# EAGLE design mc_pcb (EAGLE 7.5.0)
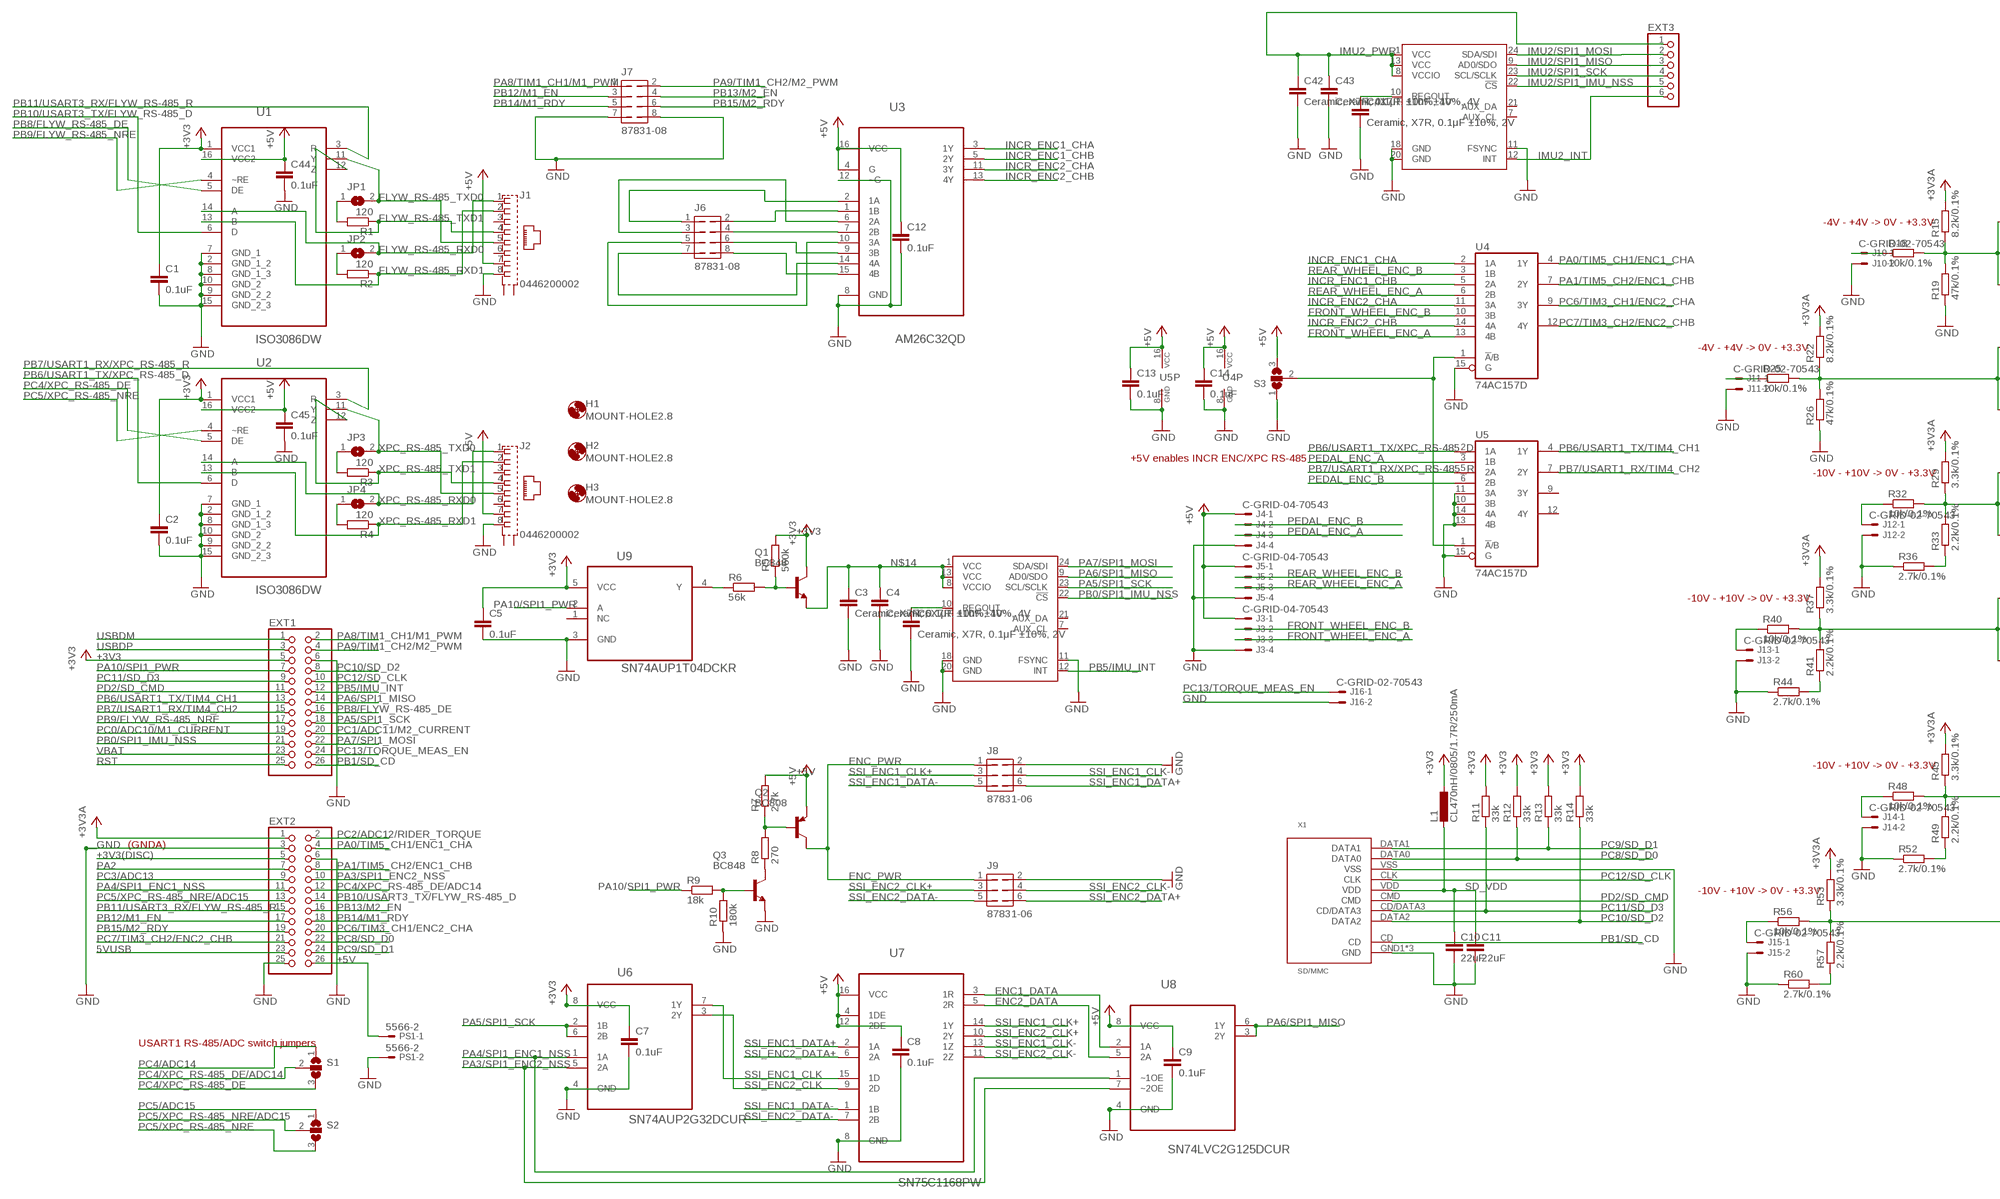
[diagram p0: schematic, sheet 1, part 1 of 2]
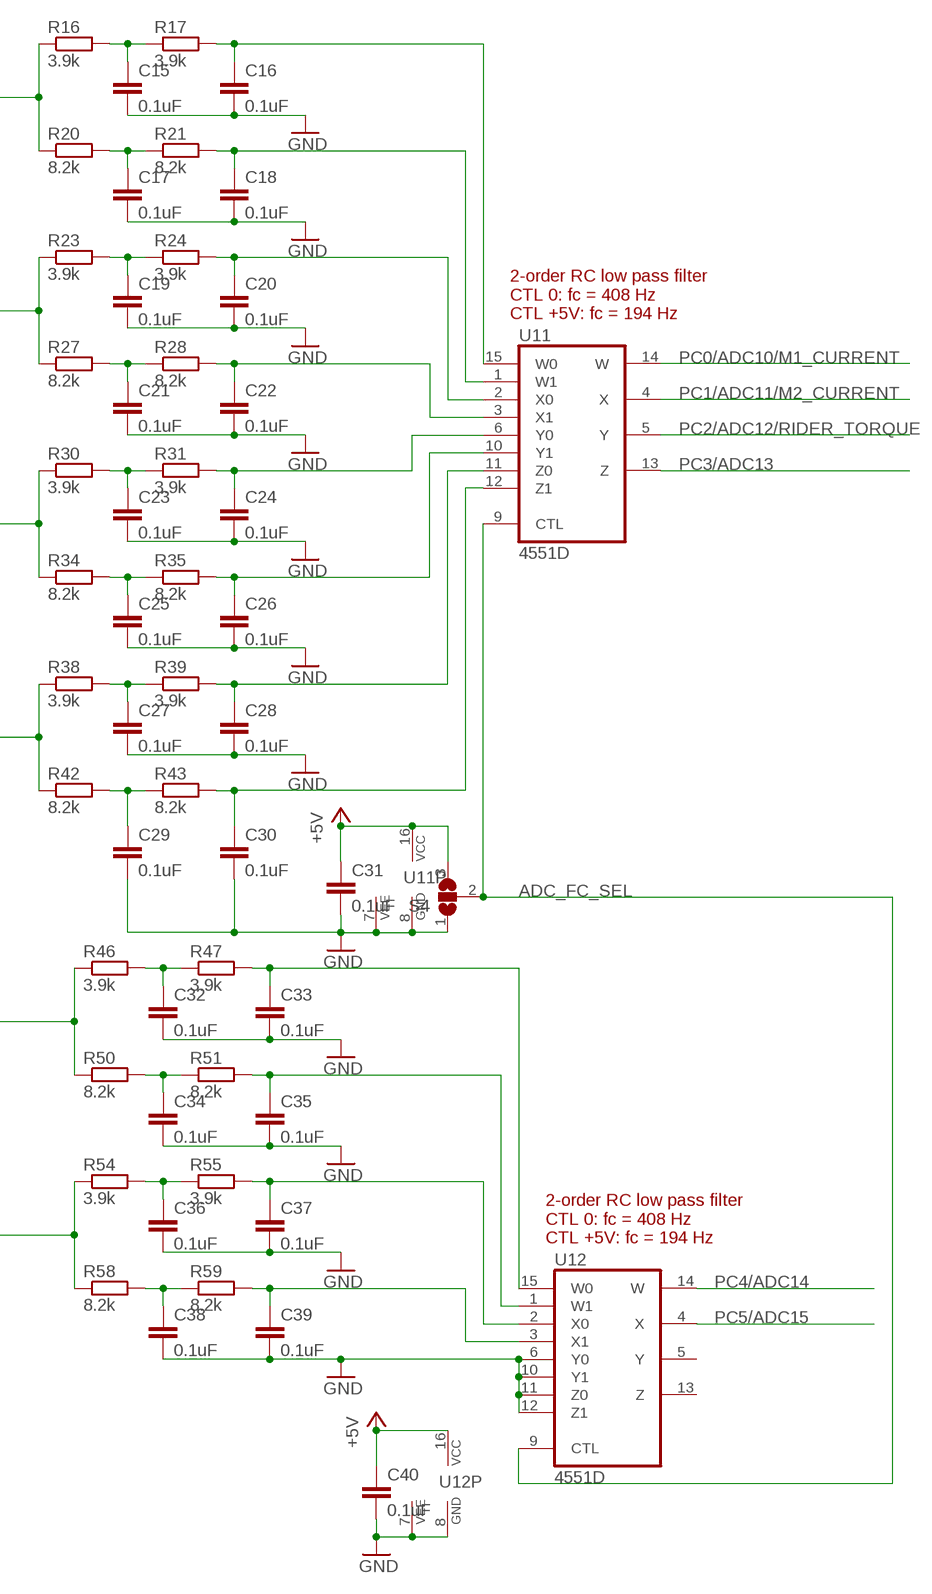
[diagram p1: schematic, sheet 1, part 2 of 2]

## Parts
C1  0.1uF  C-EUC0603  [C0603]
C2  0.1uF  C-EUC0603  [C0603]
C3  Ceramic, X7R, 0.1μF ±10%, 4V  C-EUC0603  [C0603]
C4  Ceramic, X7R, 10nF ±10%, 4V  C-EUC0603  [C0603]
C5  0.1uF  C-EUC0603  [C0603]
C6  Ceramic, X7R, 0.1μF ±10%, 2V  C-EUC0603  [C0603]
C7  0.1uF  C-EUC0603  [C0603]
C8  0.1uF  C-EUC0603  [C0603]
C9  0.1uF  C-EUC0603  [C0603]
C10  22uF  C-EUC0603  [C0603]
C11  22uF  C-EUC0603  [C0603]
C12  0.1uF  C-EUC0603  [C0603]
C13  0.1uF  C-EUC0603  [C0603]
C14  0.1uF  C-EUC0603  [C0603]
C15  0.1uF  C-EUC0603  [C0603]
C16  0.1uF  C-EUC0603  [C0603]
C17  0.1uF  C-EUC0603  [C0603]
C18  0.1uF  C-EUC0603  [C0603]
C19  0.1uF  C-EUC0603  [C0603]
C20  0.1uF  C-EUC0603  [C0603]
C21  0.1uF  C-EUC0603  [C0603]
C22  0.1uF  C-EUC0603  [C0603]
C23  0.1uF  C-EUC0603  [C0603]
C24  0.1uF  C-EUC0603  [C0603]
C25  0.1uF  C-EUC0603  [C0603]
C26  0.1uF  C-EUC0603  [C0603]
C27  0.1uF  C-EUC0603  [C0603]
C28  0.1uF  C-EUC0603  [C0603]
C29  0.1uF  C-EUC0603  [C0603]
C30  0.1uF  C-EUC0603  [C0603]
C31  0.1uF  C-EUC0603  [C0603]
C32  0.1uF  C-EUC0603  [C0603]
C33  0.1uF  C-EUC0603  [C0603]
C34  0.1uF  C-EUC0603  [C0603]
C35  0.1uF  C-EUC0603  [C0603]
C36  0.1uF  C-EUC0603  [C0603]
C37  0.1uF  C-EUC0603  [C0603]
C38  0.1uF  C-EUC0603  [C0603]
C39  0.1uF  C-EUC0603  [C0603]
C40  0.1uF  C-EUC0603  [C0603]
C41  Ceramic, X7R, 0.1μF ±10%, 2V  C-EUC0603  [C0603]
C42  Ceramic, X7R, 0.1μF ±10%, 4V  C-EUC0603  [C0603]
C43  Ceramic, X7R, 10nF ±10%, 4V  C-EUC0603  [C0603]
C44  0.1uF  C-EUC0603  [C0603]
C45  0.1uF  C-EUC0603  [C0603]
EXT1  PINHD-2X13  [2X13]
EXT2  PINHD-2X13  [2X13]
EXT3  PINHD-1X6  [1X06]
H1  MOUNT-HOLE2.8  [2,8]
H2  MOUNT-HOLE2.8  [2,8]
H3  MOUNT-HOLE2.8  [2,8]
J1  0446200002  [0446200002]
J2  0446200002  [0446200002]
J3  C-GRID-04-70543  [70543-04]
J4  C-GRID-04-70543  [70543-04]
J5  C-GRID-04-70543  [70543-04]
J6  87831-08  [87831-08]
J7  87831-08  [87831-08]
J8  87831-06  [87831-06]
J9  87831-06  [87831-06]
J10  C-GRID-02-70543  [70543-02]
J11  C-GRID-02-70543  [70543-02]
J12  C-GRID-02-70543  [70543-02]
J13  C-GRID-02-70543  [70543-02]
J14  C-GRID-02-70543  [70543-02]
J15  C-GRID-02-70543  [70543-02]
J16  C-GRID-02-70543  [70543-02]
JP1  SJ  [SJ]
JP2  SJ  [SJ]
JP3  SJ  [SJ]
JP4  SJ  [SJ]
L1  CL470nH/0805/1.7R/250mA  L-EUL2012C  [L2012C]
PS1  5566-2  [5566-2]
Q1  BC848  [SOT23]
Q2  BC808  BC808-16-PNP-SOT23-BEC  [SOT23-BEC]
Q3  BC848  [SOT23]
R1  120  R-EU_R0603  [R0603]
R2  120  R-EU_R0603  [R0603]
R3  120  R-EU_R0603  [R0603]
R4  120  R-EU_R0603  [R0603]
R5  560k  R-EU_R0603  [R0603]
R6  56k  R-EU_R0603  [R0603]
R7  2.7k  R-EU_R1210  [R1210]
R8  270  R-EU_R1210  [R1210]
R9  18k  R-EU_R0603  [R0603]
R10  180k  R-EU_R0603  [R0603]
R11  33k  R-EU_R0603  [R0603]
R12  33k  R-EU_R0603  [R0603]
R13  33k  R-EU_R0603  [R0603]
R14  33k  R-EU_R0603  [R0603]
R15  8.2k/0.1%  R-EU_R0603  [R0603]
R16  3.9k  R-EU_R0603  [R0603]
R17  3.9k  R-EU_R0603  [R0603]
R18  10k/0.1%  R-EU_R0603  [R0603]
R19  47k/0.1%  R-EU_R0603  [R0603]
R20  8.2k  R-EU_R0603  [R0603]
R21  8.2k  R-EU_R0603  [R0603]
R22  8.2k/0.1%  R-EU_R0603  [R0603]
R23  3.9k  R-EU_R0603  [R0603]
R24  3.9k  R-EU_R0603  [R0603]
R25  10k/0.1%  R-EU_R0603  [R0603]
R26  47k/0.1%  R-EU_R0603  [R0603]
R27  8.2k  R-EU_R0603  [R0603]
R28  8.2k  R-EU_R0603  [R0603]
R29  3.3k/0.1%  R-EU_R0603  [R0603]
R30  3.9k  R-EU_R0603  [R0603]
R31  3.9k  R-EU_R0603  [R0603]
R32  10k/0.1%  R-EU_R0603  [R0603]
R33  2.2k/0.1%  R-EU_R0603  [R0603]
R34  8.2k  R-EU_R0603  [R0603]
R35  8.2k  R-EU_R0603  [R0603]
R36  2.7k/0.1%  R-EU_R0603  [R0603]
R37  3.3k/0.1%  R-EU_R0603  [R0603]
R38  3.9k  R-EU_R0603  [R0603]
R39  3.9k  R-EU_R0603  [R0603]
R40  10k/0.1%  R-EU_R0603  [R0603]
R41  2.2k/0.1%  R-EU_R0603  [R0603]
R42  8.2k  R-EU_R0603  [R0603]
R43  8.2k  R-EU_R0603  [R0603]
R44  2.7k/0.1%  R-EU_R0603  [R0603]
R45  3.3k/0.1%  R-EU_R0603  [R0603]
R46  3.9k  R-EU_R0603  [R0603]
R47  3.9k  R-EU_R0603  [R0603]
R48  10k/0.1%  R-EU_R0603  [R0603]
R49  2.2k/0.1%  R-EU_R0603  [R0603]
R50  8.2k  R-EU_R0603  [R0603]
R51  8.2k  R-EU_R0603  [R0603]
R52  2.7k/0.1%  R-EU_R0603  [R0603]
R53  3.3k/0.1%  R-EU_R0603  [R0603]
R54  3.9k  R-EU_R0603  [R0603]
R55  3.9k  R-EU_R0603  [R0603]
R56  10k/0.1%  R-EU_R0603  [R0603]
R57  2.2k/0.1%  R-EU_R0603  [R0603]
R58  8.2k  R-EU_R0603  [R0603]
R59  8.2k  R-EU_R0603  [R0603]
R60  2.7k/0.1%  R-EU_R0603  [R0603]
S1  SJ2W  [SJ_2]
S2  SJ2W  [SJ_2]
S3  SJ2W  [SJ_2]
S4  SJ2W  [SJ_2]
U1  ISO3086DW  [SOIC127P1030X265-16N]
U2  ISO3086DW  [SOIC127P1030X265-16N]
U3  AM26C32QD  [SOIC127P600X175-16N]
U4  74AC157D  [SO16]
U5  74AC157D  [SO16]
U6  SN74AUP2G32DCUR  [SOP50P310X90-8N]
U7  SN75C1168PW  [SOP65P640X120-16N]
U8  SN74LVC2G125DCUR  [SOP50P310X90-8N]
U9  SN74AUP1T04DCKR  [SOT65P210X110-5N]
U10  MPU-9250  [QFN24-SMALL]
U11  4551D  [SO16]
U12  4551D  [SO16]
U13  MPU-9250  [QFN24-SMALL]
X1  10100660  [-68-6]

## Nets
5VUSB: EXT2.23
+3V3: C1.1 C2.1 C5.1 C7.1 EXT1.5 L1.1 Q1.3(C) R5.2 R11.2 R12.2 R13.2 R14.2 U1.1(VCC1) U2.1(VCC1) U6.8(VCC) U9.5(VCC)
+3V3(DISC): EXT2.5
+3V3A: EXT2.1 R15.2 R22.2 R29.2 R37.2 R45.2 R53.2
+5V: C8.1 C9.1 C12.1 C13.1 C14.1 C31.1 C40.1 C44.1 C45.1 EXT2.26 J1.7 J2.7 J3.1 J4.1 J5.1 PS1.1 Q2.E R7.2 S3.3 S4.3 U1.16(VCC2) U2.16(VCC2) U3.4(G) U3.16(VCC) U4.16(VCC) U5.16(VCC) U7.4(1DE) U7.12(2DE) U7.16(VCC) U8.8(VCC) U11.16(VCC) U12.16(VCC)
ADC_FC_SEL: S4.2 U11.9(CTL) U12.9(CTL)
ENC1_CHA+: J6.2 U3.1(1B)
ENC1_CHA-: J6.1 U3.2(1A)
ENC1_CHB+: J6.4 U3.7(2B)
ENC1_CHB-: J6.3 U3.6(2A)
ENC1_DATA: U7.3(1R) U8.2(1A)
ENC2_CHA+: J6.6 U3.9(3B)
ENC2_CHA-: J6.5 U3.10(3A)
ENC2_CHB+: J6.8 U3.15(4B)
ENC2_CHB-: J6.7 U3.14(4A)
ENC2_DATA: U7.5(2R) U8.5(2A)
ENC_PWR: J8.1 J9.1 Q2.C
FLYW_RS-485_RXD0: J1.1 JP2.2 U1.14(A)
FLYW_RS-485_RXD1: J1.2 R2.1 U1.13(B)
FLYW_RS-485_TXD0: J1.5 JP1.2 U1.11(Y)
FLYW_RS-485_TXD1: J1.4 R1.1 U1.12(Z)
FRONT_WHEEL_ENC_A: J3.3 U4.13(4B)
FRONT_WHEEL_ENC_B: J3.2 U4.10(3B)
GND: C1.2 C2.2 C3.2 C4.2 C5.2 C6.2 C7.2 C8.2 C9.2 C10.2 C11.2 C12.2 C13.2 C14.2 C15.2 C16.2 C17.2 C18.2 C19.2 C20.2 C21.2 C22.2 C23.2 C24.2 C25.2 C26.2 C27.2 C28.2 C29.2 C30.2 C31.2 C32.2 C33.2 C34.2 C35.2 C36.2 C37.2 C38.2 C39.2 C40.2 C41.2 C42.2 C43.2 C44.2 C45.2 EXT1.6 EXT2.3 EXT2.6 EXT2.25 J1.8 J2.8 J3.4 J4.4 J5.4 J7.7 J7.8 J8.2 J9.2 J10.2 J11.2 J12.2 J13.2 J14.2 J15.2 J16.2 PS1.2 Q3.2(E) R10.1 R19.1 R26.1 R36.1 R44.1 R52.1 R60.1 S3.1 S4.1 U1.2(GND_1_2) U1.7(GND_1) U1.8(GND_1_3) U1.9(GND_2_2) U1.10(GND_2) U1.15(GND_2_3) U2.2(GND_1_2) U2.7(GND_1) U2.8(GND_1_3) U2.9(GND_2_2) U2.10(GND_2) U2.15(GND_2_3) U3.8(GND) U3.12(~G) U4.8(GND) U4.15(G) U5.8(GND) U5.10(3B) U5.11(3A) U5.13(4B) U5.14(4A) U5.15(G) U6.4(GND) U7.8(GND) U8.4(GND) U9.3(GND) U10.11(FSYNC) U10.18(GND) U10.20(GND) U11.7(VEE) U11.8(GND) U12.6(Y0) U12.7(VEE) U12.8(GND) U12.10(Y1) U12.11(Z0) U12.12(Z1) U13.11(FSYNC) U13.18(GND) U13.20(GND) X1.GND1(GND) X1.GND2(GND) X1.GND3(GND) X1.VSS
IMU2/SPI1_IMU_NSS: EXT3.5 U13.22(!CS)
IMU2/SPI1_MISO: EXT3.3 U13.9(AD0/SDO)
IMU2/SPI1_MOSI: EXT3.2 U13.24(SDA/SDI)
IMU2/SPI1_SCK: EXT3.4 U13.23(SCL/SCLK)
IMU2_INT: EXT3.6 U13.12(INT)
IMU2_PWR: C42.1 C43.1 EXT3.1 U13.1(VCC) U13.8(VCCIO) U13.13(VCC)
INCR_ENC1_CHA: U3.3(1Y) U4.2(1A)
INCR_ENC1_CHB: U3.5(2Y) U4.5(2A)
INCR_ENC2_CHA: U3.11(3Y) U4.11(3A)
INCR_ENC2_CHB: U3.13(4Y) U4.14(4A)
N$1: C6.1 U10.10(REGOUT)
N$2: Q1.1(B) R5.1 R6.2
N$3: Q2.B R7.1 R8.2
N$4: Q3.3(C) R8.1
N$5: Q3.1(B) R9.2 R10.2
N$6: R33.1 R36.2
N$10: R29.1 R30.1 R32.2 R33.2 R34.1
N$12: C41.1 U13.10(REGOUT)
N$14: C3.1 C4.1 Q1.2(E) U10.1(VCC) U10.8(VCCIO) U10.13(VCC)
N$15: R15.1 R16.1 R18.2 R19.2 R20.1
N$17: R37.1 R38.1 R40.2 R41.2 R42.1
N$20: JP1.1 R1.2
N$24: JP3.1 R3.2
N$27: C32.1 R46.2 R47.1
N$28: C33.1 R47.2 U12.15(W0)
N$29: C34.1 R50.2 R51.1
N$31: C35.1 R51.2 U12.1(W1)
N$32: C36.1 R54.2 R55.1
N$33: C37.1 R55.2 U12.2(X0)
N$34: C38.1 R58.2 R59.1
N$35: C39.1 R59.2 U12.3(X1)
N$37: R6.1 U9.4(Y)
N$42: J15.1 R56.1
N$45: R22.1 R23.1 R25.2 R26.2 R27.1
N$47: J14.1 R48.1
N$49: S3.2 U4.1(!A!/B) U5.1(!A!/B)
N$50: J12.1 R32.1
N$51: JP2.1 R2.2
N$52: JP4.1 R4.2
N$53: J10.1 R18.1
N$56: C23.1 R30.2 R31.1
N$57: C24.1 R31.2 U11.6(Y0)
N$58: R41.1 R44.2
N$59: R45.1 R46.1 R48.2 R49.2 R50.1
N$60: R49.1 R52.2
N$61: R53.1 R54.1 R56.2 R57.2 R58.1
N$62: R57.1 R60.2
N$63: J13.1 R40.1
N$64: C25.1 R34.2 R35.1
N$65: C26.1 R35.2 U11.10(Y1)
N$66: C27.1 R38.2 R39.1
N$67: C28.1 R39.2 U11.11(Z0)
N$68: C29.1 R42.2 R43.1
N$69: C30.1 R43.2 U11.12(Z1)
N$70: C15.1 R16.2 R17.1
N$71: C16.1 R17.2 U11.15(W0)
N$72: C17.1 R20.2 R21.1
N$73: C18.1 R21.2 U11.1(W1)
N$74: C19.1 R23.2 R24.1
N$75: C20.1 R24.2 U11.2(X0)
N$76: C21.1 R27.2 R28.1
N$77: C22.1 R28.2 U11.3(X1)
PA0/TIM5_CH1/ENC1_CHA: EXT2.4 U4.4(1Y)
PA1/TIM5_CH2/ENC1_CHB: EXT2.8 U4.7(2Y)
PA2: EXT2.7
PA3/SPI1_ENC2_NSS: EXT2.10 U6.5(2A) U8.7(~2OE)
PA4/SPI1_ENC1_NSS: EXT2.11 U6.1(1A) U8.1(~1OE)
PA5/SPI1_SCK: EXT1.18 U6.2(1B) U6.6(2B) U10.23(SCL/SCLK)
PA6/SPI1_MISO: EXT1.14 U8.3(2Y) U8.6(1Y) U10.9(AD0/SDO)
PA7/SPI1_MOSI: EXT1.22 U10.24(SDA/SDI)
PA8/TIM1_CH1/M1_PWM: EXT1.2 J7.1
PA9/TIM1_CH2/M2_PWM: EXT1.4 J7.2
PA10/SPI1_PWR: EXT1.7 R9.1 U9.2(A)
PB0/SPI1_IMU_NSS: EXT1.21 U10.22(!CS)
PB1/SD_CD: EXT1.26 X1.CD
PB5/IMU_INT: EXT1.12 U10.12(INT)
PB6/USART1_TX/TIM4_CH1: EXT1.13 U5.4(1Y)
PB6/USART1_TX/XPC_RS-485_D: U2.6(D) U5.2(1A)
PB7/USART1_RX/TIM4_CH2: EXT1.15 U5.7(2Y)
PB7/USART1_RX/XPC_RS-485_R: U2.3(R) U5.5(2A)
PB8/FLYW_RS-485_DE: EXT1.16 U1.5(DE)
PB9/FLYW_RS-485_NRE: EXT1.17 U1.4(~RE)
PB10/USART3_TX/FLYW_RS-485_D: EXT2.14 U1.6(D)
PB11/USART3_RX/FLYW_RS-485_R: EXT2.15 U1.3(R)
PB12/M1_EN: EXT2.17 J7.3
PB13/M2_EN: EXT2.16 J7.4
PB14/M1_RDY: EXT2.18 J7.5
PB15/M2_RDY: EXT2.19 J7.6
PC0/ADC10/M1_CURRENT: EXT1.19 U11.14(W)
PC1/ADC11/M2_CURRENT: EXT1.20 U11.4(X)
PC2/ADC12/RIDER_TORQUE: EXT2.2 U11.5(Y)
PC3/ADC13: EXT2.9 U11.13(Z)
PC4/ADC14: S1.1 U12.14(W)
PC4/XPC_RS-485_DE: S1.3 U2.5(DE)
PC4/XPC_RS-485_DE/ADC14: EXT2.12 S1.2
PC5/ADC15: S2.1 U12.4(X)
PC5/XPC_RS-485_NRE: S2.3 U2.4(~RE)
PC5/XPC_RS-485_NRE/ADC15: EXT2.13 S2.2
PC6/TIM3_CH1/ENC2_CHA: EXT2.20 U4.9(3Y)
PC7/TIM3_CH2/ENC2_CHB: EXT2.21 U4.12(4Y)
PC8/SD_D0: EXT2.22 R12.1 X1.DATA0
PC9/SD_D1: EXT2.24 R13.1 X1.DATA1
PC10/SD_D2: EXT1.8 R14.1 X1.DATA2
PC11/SD_D3: EXT1.9 R11.1 X1.CD/DATA3
PC12/SD_CLK: EXT1.10 X1.CLK
PC13/TORQUE_MEAS_EN: EXT1.24 J16.1
PD2/SD_CMD: EXT1.11 X1.CMD
PEDAL_ENC_A: J4.3 U5.3(1B)
PEDAL_ENC_B: J4.2 U5.6(2B)
REAR_WHEEL_ENC_A: J5.3 U4.6(2B)
REAR_WHEEL_ENC_B: J5.2 U4.3(1B)
RST: EXT1.25
SD_VDD: C10.1 C11.1 L1.2 X1.VDD
SSI_ENC1_CLK: U6.7(1Y) U7.15(1D)
SSI_ENC1_CLK+: J8.3 U7.14(1Y)
SSI_ENC1_CLK-: J8.4 U7.13(1Z)
SSI_ENC1_DATA+: J8.6 U7.2(1A)
SSI_ENC1_DATA-: J8.5 U7.1(1B)
SSI_ENC2_CLK: U6.3(2Y) U7.9(2D)
SSI_ENC2_CLK+: J9.3 U7.10(2Y)
SSI_ENC2_CLK-: J9.4 U7.11(2Z)
SSI_ENC2_DATA+: J9.6 U7.6(2A)
SSI_ENC2_DATA-: J9.5 U7.7(2B)
USBDM: EXT1.1
USBDP: EXT1.3
VBAT: EXT1.23
X124: J11.1 R25.1
XPC_RS-485_RXD0: J2.1 JP4.2 U2.14(A)
XPC_RS-485_RXD1: J2.2 R4.1 U2.13(B)
XPC_RS-485_TXD0: J2.5 JP3.2 U2.11(Y)
XPC_RS-485_TXD1: J2.4 R3.1 U2.12(Z)
Unconnected: J1.3 J1.6 J1.S@1(S1) J1.S@2(S2) J2.3 J2.6 J2.S@1(S1) J2.S@2(S2) U5.9(3Y) U5.12(4Y) U9.1(NC) U10.7(AUX_CL) U10.21(AUX_DA) U12.5(Y) U12.13(Z) U13.7(AUX_CL) U13.21(AUX_DA)

## Notes on the sheet
- -4V - +4V -> 0V - +3.3V
- -4V - +4V -> 0V - +3.3V
- 2-order RC low pass filter
  CTL 0: fc = 408 Hz
  CTL +5V: fc = 194 Hz
- +5V enables INCR ENC/XPC RS-485
- -10V - +10V -> 0V - +3.3V
- -10V - +10V -> 0V - +3.3V
- -10V - +10V -> 0V - +3.3V
- (GNDA)
- -10V - +10V -> 0V - +3.3V
- 2-order RC low pass filter
  CTL 0: fc = 408 Hz
  CTL +5V: fc = 194 Hz
- USART1 RS-485/ADC switch jumpers

## Library data of the parts
C1-C45 = rcl:C-EU: CAPACITOR, European symbol
EXT1 EXT2 = pinhead:PINHD-2X13: PIN HEADER
EXT3 = pinhead:PINHD-1X6: PIN HEADER
H1-H3 = holes:MOUNT-HOLE: MOUNTING HOLE with drill center marker
J1 J2 = con-molex:0446200002: RJ-45 INVERTED MODULAR JACK ASSEMBLY WITH RJ-11 KEEPOUT FEATURE Source: Data sheet <http://www.farnell.com/datasheets/73207.pdf> MOLEX 0446200002 BUCHSE, RJ45, GESCHIRMT Source: Farnell <http://de.farnell.com/molex/0446200002/buchse-rj45-geschirmt/dp/9251910?ost=9251910>; MF: MOLEX; MPN: 0446200002; OC_FARNELL: 9251910
J3-J5 = con-molex:C-GRID-04: CONNECTOR wire to board 2.54 mm (0.100") pitch header; OC_FARNELL: unknown; OC_NEWARK: unknown
J6 J7 = components:87831-08: Milli-Grid Header 2.00mm (.079") Pitch; OC_FARNELL: unknown; OC_NEWARK: unknown
J8 J9 = components:87831-06: Milli-Grid Header 2.00mm (.079") Pitch; OC_FARNELL: 1756947; OC_NEWARK: unknown
J10-J16 = con-molex:C-GRID-02: CONNECTOR wire to board 2.54 mm (0.100") pitch header; OC_FARNELL: unknown; OC_NEWARK: unknown
JP1-JP4 = jumper:SJ: SMD solder JUMPER
L1 = rcl:L-EU: INDUCTOR, European symbol
PS1 = con-molex:5566-2: Mini FIT connector 2 pol Source: http://www.molex.com; OC_FARNELL: 1822072; OC_NEWARK: unknown
Q1 Q3 = transistor:BC848: NPN TRANSISTOR
Q2 = transistor:*-PNP-: PNP Transistror
R1-R60 = rcl:R-EU_: RESISTOR, European symbol
S1-S4 = jumper:SJ2W: SMD solder JUMPER
U1 U2 = Texas_Instruments_By_element14_Batch_1:ISO3086DW: ISOLATED 5-V FULL AND HALF-DUPLEX RS-485 TRANSCEIVERS; MPN: ISO3080DW; OC_FARNELL: 1755041; OC_NEWARK: 13N4115; PACKAGE: SOIC-16; SUPPLIER: TEXAS INSTRUMENTS
U3 = Texas Instruments_By_element14_Batch_1:AM26C32QD: QUADRUPLE DIFFERENTIAL LINE RECEIVER; MPN: AM26C32QD; OC_FARNELL: -; OC_NEWARK: 50R9732; PACKAGE: SOIC-16; SUPPLIER: Texas Instruments
U4 U5 = 74xx-eu:74*157: Quadruple 2-line to 1-line data SELECTOR/MULTIPLEXER
U6 = Texas Instruments_By_element14_Batch_1:SN74AUP2G32DCUR: LOW-POWER DUAL 2-INPUT POSITIVE-OR GATE; MPN: SN74AUP2G32DCUR; OC_FARNELL: -; OC_NEWARK: 64R0600; PACKAGE: SOP-8; SUPPLIER: Texas Instruments
U7 = Texas Instruments_By_element14_Batch_1:SN75C1168PW: DUAL DIFFERENTIAL DRIVERS AND RECEIVERS; MPN: SN75C1168PW; OC_FARNELL: 4904163; OC_NEWARK: 02H5485; PACKAGE: TSSOP-16; SUPPLIER: Texas Instruments
U8 = Texas Instruments_By_element14_Batch_1:SN74LVC2G125DCUR: DUAL BUS BUFFER; MPN: SN74LVC2G125DCUR; OC_FARNELL: 1287415; OC_NEWARK: 76C4200; PACKAGE: VSSOP-8; SUPPLIER: Texas Instruments
U9 = Texas Instruments_By_element14_Batch_1:SN74AUP1T04DCKR: LOW POWER, 1.8/2.5/3.3-V INPUT, 3.3-V CMOS OUTPUT, SINGLE INVERTER GATE; MPN: SN74AUP1T04DCKR; OC_FARNELL: -; OC_NEWARK: 74R6552; PACKAGE: SC70-5; SUPPLIER: Texas Instruments
U10 U13 = MPU-9250:MPU-9250
U11 U12 = 45xx:4551: Quad 2-channel analog MULTIPLEXER/DEMULTIPLEXER
X1 = components:10100660: AMPHENOL microDS push push connector (9pin)

## Board
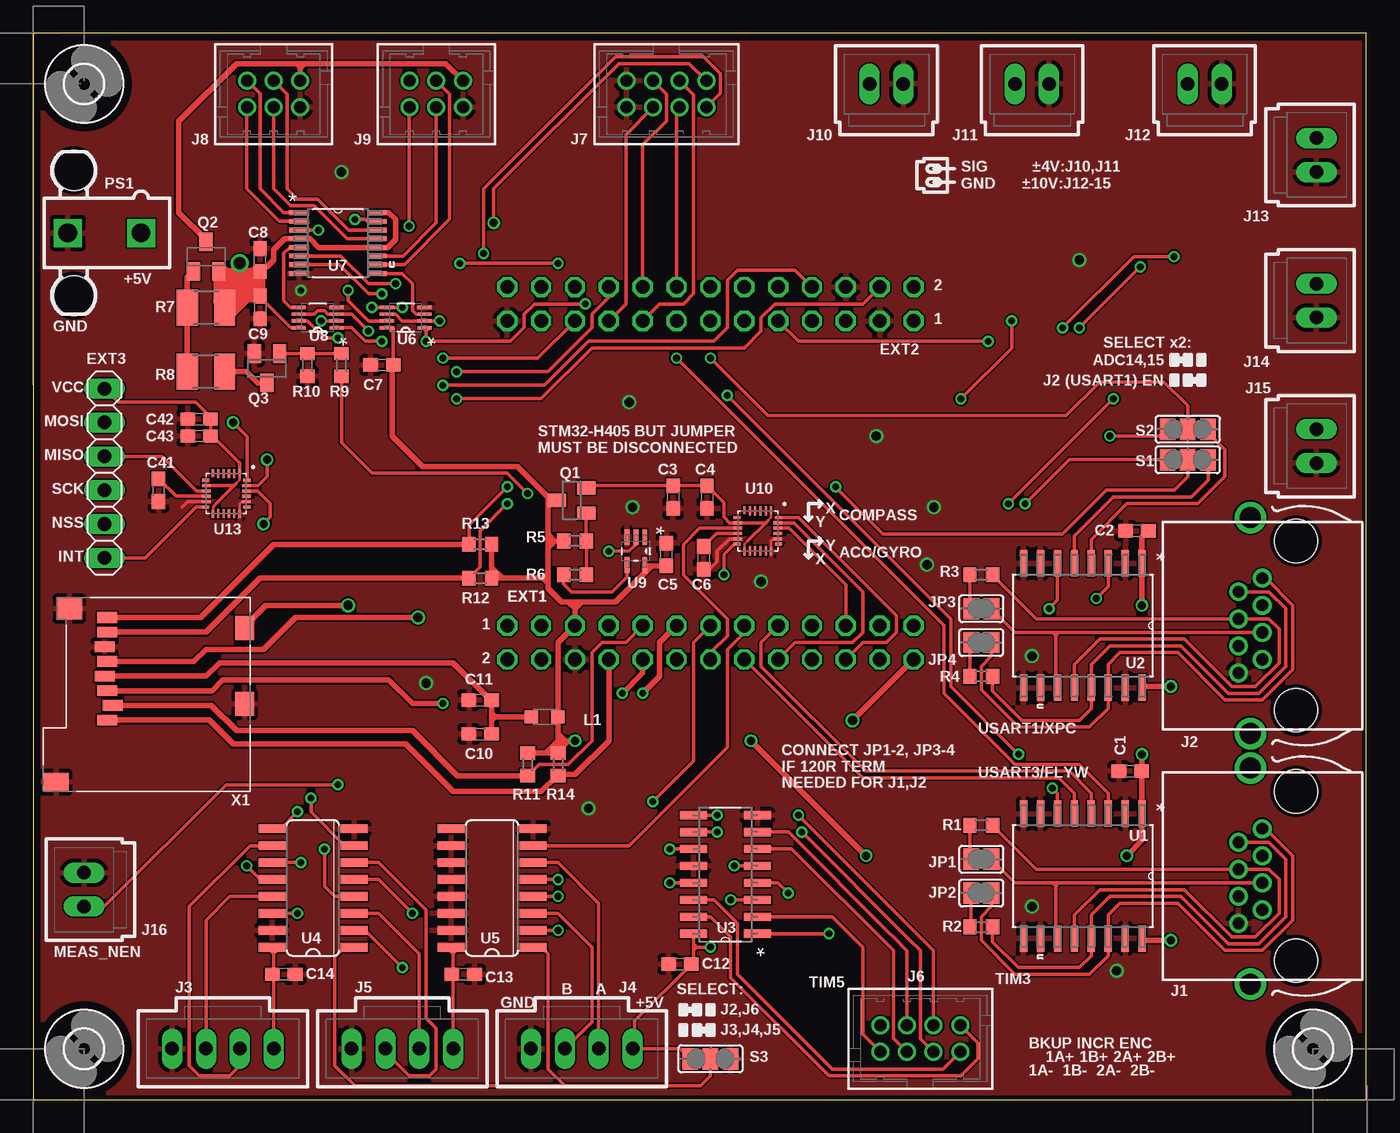
[diagram p2: board, top side]
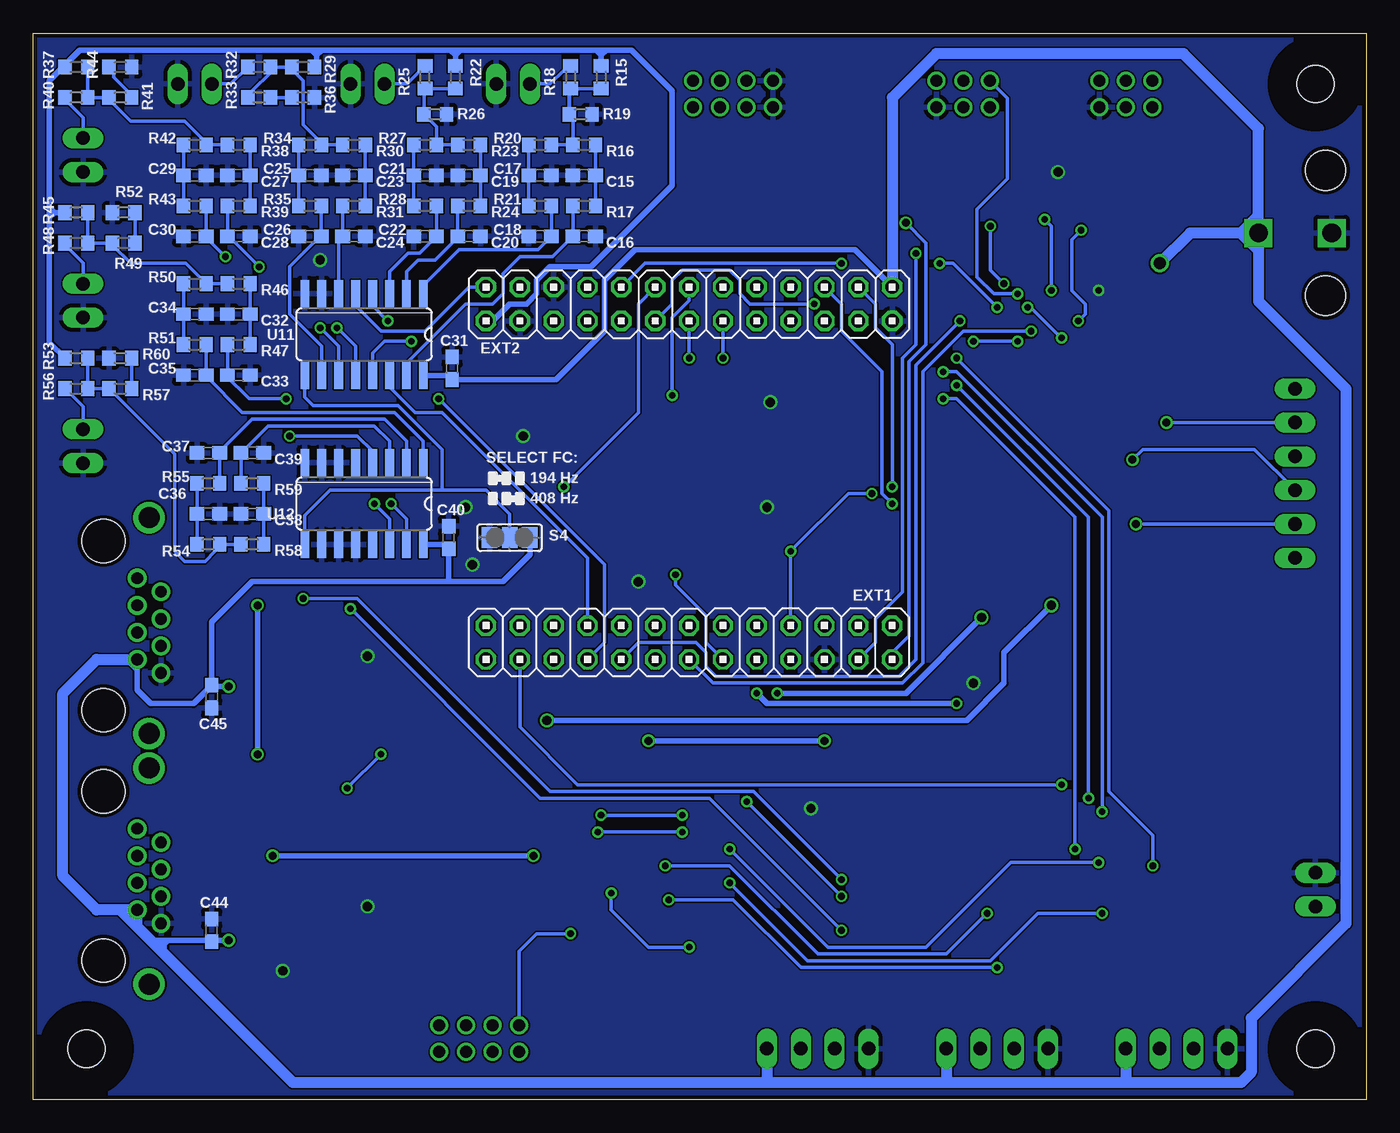
[diagram p3: board, bottom side, seen from below]

Size 100 x 80 mm. Coordinates in mm from the lower left corner, seen from the top.
Outline: 0,0 100,0 100,80 0,80 0,0
Copper layers (1*16): Top 0.035mm / dielectric 1.55mm / Bottom 0.035mm
Design rules "Eagle_WEdirekt_125_check *": minimum track width 0.125mm, minimum drill 0.2mm, track to track 0.125mm, track to pad 0.125mm, pad to pad 0.17mm, via to via 0.125mm, smd to smd 0.17mm, copper to edge 0.3mm, drill to drill 0.6mm, minimum pad ring 0.225mm, minimum via ring 0.175mm, stop-mask expansion 0.05mm, vias tented up to drill 0mil, thermal gap 0.3mm

### Footprints (pad centres in the part's own frame; a part is rotated, then mirrored left to right if it is on the bottom)
C0603 = smd 1.1 x 1: 1 -0.85,0; 2 0.85,0
2X13 = drill 1.016 octagon: 1 -15.24,-1.27; 2 -15.24,1.27; 3 -12.7,-1.27; 4 -12.7,1.27; 5 -10.16,-1.27; 6 -10.16,1.27; 7 -7.62,-1.27; 8 -7.62,1.27; 9 -5.08,-1.27; 10 -5.08,1.27; 11 -2.54,-1.27; 12 -2.54,1.27; 13 0,-1.27; 14 0,1.27; 15 2.54,-1.27; 16 2.54,1.27; 17 5.08,-1.27; 18 5.08,1.27; 19 7.62,-1.27; 20 7.62,1.27; 21 10.16,-1.27; 22 10.16,1.27; 23 12.7,-1.27; 24 12.7,1.27; 25 15.24,-1.27; 26 15.24,1.27
1X06 = drill 1.016 long: 1 -6.35,0; 2 -3.81,0; 3 -1.27,0; 4 1.27,0; 5 3.81,0; 6 6.35,0
2,8 = hole 2.8: 0,0
0446200002 = drill 0.889 pad 1.422: 1 3.556,2.54; 2 2.54,4.318; 3 1.524,2.54; 4 0.508,4.318; 5 -0.508,2.54; 6 -1.524,4.318; 7 -2.54,2.54; 8 -3.556,4.318 | drill 1.575 pad 2.286: S@1 -8.103,3.429; S@2 8.103,3.429 | hole 3.251: 6.35,0; -6.35,0
70543-04 = drill 1.016 long: 1 -3.81,0; 2 -1.27,0; 3 1.27,0; 4 3.81,0
87831-08 = drill 0.9: 1 -3,-1; 2 -3,1; 3 -1,-1; 4 -1,1; 5 1,-1; 6 1,1; 7 3,-1; 8 3,1
87831-06 = drill 0.9: 1 -2,-1; 2 -2,1; 3 0,-1; 4 0,1; 5 2,-1; 6 2,1
70543-02 = drill 1.016 long: 1 -1.27,0; 2 1.27,0
SJ = smd 1.168 x 1.6: 1 -0.762,0; 2 0.762,0
L2012C = smd 1 x 1: 1 -1,0; 2 1,0
5566-2 = drill 1.4 square: 1 0,-2.75; 2 0,2.75 | hole 3: 4.7,2.29; -4.7,2.29
SOT23 = smd 1 x 1.4: 1 -0.95,-1.1; 2 0.95,-1.1; 3 0,1.1
SOT23-BEC = smd 1 x 1.4: B -0.95,-1.1; C 0,1.1; E 0.95,-1.1
R0603 = smd 1 x 1.1: 1 -0.85,0; 2 0.85,0
R1210 = smd 1.6 x 2.7: 1 -1.4,0; 2 1.4,0
SJ_2 = smd 1.168 x 1.6: 1 -1.524,0; 2 0,0; 3 1.524,0
SOIC127P1030X265-16N = smd 1.981 x 0.559: 1 -4.674,4.445; 2 -4.674,3.175; 3 -4.674,1.905; 4 -4.674,0.635; 5 -4.674,-0.635; 6 -4.674,-1.905; 7 -4.674,-3.175; 8 -4.674,-4.445; 9 4.674,-4.445; 10 4.674,-3.175; 11 4.674,-1.905; 12 4.674,-0.635; 13 4.674,0.635; 14 4.674,1.905; 15 4.674,3.175; 16 4.674,4.445
SOIC127P600X175-16N = smd 2.057 x 0.61: 1 -4.801,8.89; 2 -4.801,7.62; 3 -4.801,6.35; 4 -4.801,5.08; 5 -4.801,3.81; 6 -4.801,2.54; 7 -4.801,1.27; 8 -4.801,0; 9 0,0; 10 0,1.27; 11 0,2.54; 12 0,3.81; 13 0,5.08; 14 0,6.35; 15 0,7.62; 16 0,8.89
SO16 = smd 0.66 x 2.032: 1 -4.445,-3.073; 2 -3.175,-3.073; 3 -1.905,-3.073; 4 -0.635,-3.073; 5 0.635,-3.073; 6 1.905,-3.073; 7 3.175,-3.073; 8 4.445,-3.073; 9 4.445,3.073; 10 3.175,3.073; 11 1.905,3.073; 12 0.635,3.073; 13 -0.635,3.073; 14 -1.905,3.073; 15 -3.175,3.073; 16 -4.445,3.073
SOP50P310X90-8N = smd 1.067 x 0.254: 1 -1.422,0.762; 2 -1.422,0.254; 3 -1.422,-0.254; 4 -1.422,-0.762; 5 1.422,-0.762; 6 1.422,-0.254; 7 1.422,0.254; 8 1.422,0.762
SOP65P640X120-16N = smd 1.473 x 0.356: 1 -2.921,2.286; 2 -2.921,1.626; 3 -2.921,0.965; 4 -2.921,0.33; 5 -2.921,-0.33; 6 -2.921,-0.965; 7 -2.921,-1.626; 8 -2.921,-2.286; 9 2.921,-2.286; 10 2.921,-1.626; 11 2.921,-0.965; 12 2.921,-0.33; 13 2.921,0.33; 14 2.921,0.965; 15 2.921,1.626; 16 2.921,2.286
SOT65P210X110-5N = smd 1.168 x 0.356: 1 -1.041,0.66; 2 -1.041,0; 3 -1.041,-0.66; 4 1.041,-0.66; 5 1.041,0.66
QFN24-SMALL = smd 0.6 x 0.23: 1 -1.55,1; 6 -1.55,-1; 13 1.55,-1; 18 1.55,1 | smd 0.7 x 0.23: 2 -1.5,0.6; 3 -1.5,0.2; 4 -1.5,-0.2; 5 -1.5,-0.6; 14 1.5,-0.6; 15 1.5,-0.2; 16 1.5,0.2; 17 1.5,0.6 | smd 0.23 x 0.6: 7 -1,-1.55; 12 1,-1.55; 19 1,1.55; 24 -1,1.55 | smd 0.23 x 0.7: 8 -0.6,-1.5; 9 -0.2,-1.5; 10 0.2,-1.5; 11 0.6,-1.5; 20 0.6,1.5; 21 0.2,1.5; 22 -0.2,1.5; 23 -0.6,1.5
-68-6 = smd 1.4 x 1.8: CD 7.22,4.63; GND3 7.22,-1.07 | smd 1.5 x 0.8: CD/DATA3 -2.68,-1.16; CLK -3.08,2.14; CMD -3.08,-0.06; DATA0 -3.08,4.34; DATA1 -3.08,5.44; DATA2 -3.08,-2.26; VDD -3.28,1.04; VSS -3.28,3.24 | smd 1.9 x 1.4: GND1 -6.93,-6.92 | smd 1.9 x 1.65: GND2 -5.93,6.105

### Placement (x,y rotation side)
C1  82.3,24.64 180 top
C2  82.8,42.67 180 top
C3  48.01,45.21 270 top
C4  50.55,45.21 270 top
C5  47.5,40.89 90 top
C6  50.29,40.64 270 top
C7  26.16,55.12 180 top
C8  17.02,62.99 90 top
C9  17.02,59.44 270 top
C10  33.53,27.43 180 top
C11  33.53,29.97 180 top
C12  48.51,10.16 180 top
C13  32.26,9.4 0 top
C14  18.8,9.4 0 top
C15  58.67,69.34 180 bottom
C16  58.67,64.77 0 bottom
C17  61.98,69.34 0 bottom
C18  61.98,64.77 180 bottom
C19  67.31,69.34 180 bottom
C20  67.31,64.77 0 bottom
C21  70.61,69.34 0 bottom
C22  70.61,64.77 180 bottom
C23  75.95,69.34 180 bottom
C24  75.95,64.77 0 bottom
C25  79.25,69.34 0 bottom
C26  79.25,64.77 180 bottom
C27  84.58,69.34 180 bottom
C28  84.58,64.77 0 bottom
C29  87.88,69.34 0 bottom
C30  87.88,64.77 180 bottom
C31  68.58,54.86 90 bottom
C32  84.58,58.93 180 bottom
C33  84.58,54.36 0 bottom
C34  87.88,58.93 0 bottom
C35  87.88,54.36 180 bottom
C36  86.87,43.94 0 bottom
C37  86.87,48.51 180 bottom
C38  83.57,43.94 180 bottom
C39  83.57,48.51 0 bottom
C40  68.83,42.16 90 bottom
C41  9.4,45.72 270 top
C42  12.45,51.05 180 top
C43  12.45,49.78 180 top
C44  86.61,12.7 90 bottom
C45  86.61,30.23 270 bottom
EXT1  50.8,34.29 180 bottom
EXT2  50.8,59.69 0 bottom
EXT3  5.33,46.99 270 top
H1  3.81,3.81 0 top
H2  96.01,3.81 0 top
H3  3.81,76.2 0 top
J1  94.74,16.76 90 top
J2  94.74,35.56 90 top
J3  14.22,3.81 180 top
J4  41.15,3.81 180 top
J5  27.69,3.81 180 top
J6  66.55,4.57 0 top
J7  47.5,75.44 180 top
J8  18.03,75.44 180 top
J9  30.23,75.44 180 top
J10  64.01,76.2 0 top
J11  74.93,76.2 0 top
J12  87.88,76.2 0 top
J13  96.27,70.87 270 top
J14  96.27,59.94 270 top
J15  96.27,49.02 270 top
J16  3.81,15.75 90 top
JP1  71.12,18.03 0 top
JP2  71.12,15.49 0 top
JP3  71.12,36.83 0 top
JP4  71.12,34.29 0 top
L1  38.35,28.7 180 top
PS1  5.33,65.02 90 top
Q1  40.39,44.96 90 top
Q2  12.95,63.25 0 top
Q3  17.53,54.86 180 top
R1  71.12,20.57 180 top
R2  71.12,12.95 180 top
R3  71.12,39.37 180 top
R4  71.12,31.75 180 top
R5  40.64,41.91 180 top
R6  40.64,39.37 0 top
R7  12.95,59.44 0 top
R8  12.95,54.61 180 top
R9  23.11,55.12 90 top
R10  20.57,55.12 90 top
R11  37.08,25.15 90 top
R12  33.53,39.12 0 top
R13  33.53,41.66 0 top
R14  39.37,25.15 90 top
R15  57.4,76.71 90 bottom
R16  58.67,71.63 0 bottom
R17  58.67,67.06 180 bottom
R18  59.69,76.71 270 bottom
R19  58.93,73.91 180 bottom
R20  61.98,71.63 180 bottom
R21  61.98,67.06 0 bottom
R22  68.33,76.71 90 bottom
R23  67.31,71.63 0 bottom
R24  67.31,67.06 180 bottom
R25  70.61,76.71 270 bottom
R26  69.85,73.91 180 bottom
R27  70.61,71.63 180 bottom
R28  70.61,67.06 0 bottom
R29  79.76,77.47 0 bottom
R30  75.95,71.63 0 bottom
R31  75.95,67.06 180 bottom
R32  83.06,77.47 0 bottom
R33  83.06,75.18 180 bottom
R34  79.25,71.63 180 bottom
R35  79.25,67.06 0 bottom
R36  79.76,75.18 180 bottom
R37  96.77,77.47 180 bottom
R38  84.58,71.63 0 bottom
R39  84.58,67.06 180 bottom
R40  96.77,75.18 0 bottom
R41  93.47,75.18 180 bottom
R42  87.88,71.63 180 bottom
R43  87.88,67.06 0 bottom
R44  93.47,77.47 180 bottom
R45  96.77,66.55 180 bottom
R46  84.58,61.21 0 bottom
R47  84.58,56.64 180 bottom
R48  96.77,64.26 0 bottom
R49  93.22,64.26 180 bottom
R50  87.88,61.21 180 bottom
R51  87.88,56.64 0 bottom
R52  93.22,66.55 0 bottom
R53  96.77,55.63 180 bottom
R54  86.87,41.66 180 bottom
R55  86.87,46.23 0 bottom
R56  96.77,53.34 0 bottom
R57  93.47,53.34 180 bottom
R58  83.57,41.66 0 bottom
R59  83.57,46.23 180 bottom
R60  93.47,55.63 0 bottom
S1  86.61,48.01 0 top
S2  86.61,50.29 0 top
S3  50.8,3.05 180 top
S4  64.26,42.16 0 bottom
U1  78.74,16.76 270 top
U2  78.74,35.56 270 top
U3  49.53,21.34 180 top
U4  20.98,15.88 90 top
U5  34.42,15.88 90 top
U6  27.94,58.67 180 top
U7  22.86,64.26 0 top
U8  21.34,58.67 180 top
U9  45.21,41.15 270 top
U10  54.36,42.67 270 top
U11  75.18,57.4 180 bottom
U12  75.18,44.7 180 bottom
U13  14.48,45.47 270 top
X1  8.64,30.73 0 top

### Tracks (layer width: path | path; a pad name or v marks a point on that pad's centre or on a via)
+3V3  (via drill 0.6)
  Top 0.254: 26.16,57.91 U6.8 26.67,57.91 | 26.67,57.91 27.01,57.91 C7.1 | R13.2 R12.2 | 34.38,39.2 34.29,39.12 | 38.1,39.12 38.61,39.12 | 38.1,39.12 38.61,38.61 | 38.1,39.12 38.61,39.62 | 34.39,40.03 35.31,39.12 | 38.48,25.98 39.37,26.87 | 26.67,57.91 27,57.58 | 38.33,26.01 39.27,26.95 39.28,26.94 39.35,26.94 | 39.32,26.29 39.92,26.89 | 39.92,26.89 39.98,26.95 | 34.47,39.73 35.03,39.17 35.03,39.14 35.05,39.12 | 39.88,26.92 39.92,26.89
  Top 0.406: 41.15,37.34 43.69,37.34 45.87,39.52 | 41.15,37.34 40.64,37.34 | 40.64,37.34 40.13,37.34 | 40.13,37.34 39.62,37.34 38.61,38.35 38.61,38.61 38.61,39.12 38.61,39.62 38.61,41.4 | 40.64,36.83 EXT1.5 39.37,34.29 39.37,28.72 L1.1 39.35,26.94 39.37,26.92 | 40.64,36.83 40.64,37.34 | 38.61,41.4 38.61,41.91 | 38.61,41.91 38.61,42.42 | 38.61,42.42 38.61,44.96 | 38.61,44.96 Q1.3 | R5.2 39.12,41.91 | 39.12,41.91 38.61,41.91 | 38.61,44.96 38.61,45.21 36.32,47.5 29.21,47.5 26.92,49.78 26.92,55.03 C7.1 | R11.2 R14.2 39.37,26.87 39.37,26.92 | v40.64,26.92 40.13,26.92 | 40.13,26.92 39.88,26.92 | 39.88,26.92 39.37,26.92 | v53.85,26.92 v62.48,18.29 | C5.1 45.94,40.04 U9.5 45.87,39.52 | 40.64,36.83 41.15,37.34 | 40.13,37.34 40.64,36.83 | 39.12,41.91 38.61,41.4 | 39.12,41.91 38.61,42.42 | R13.2 34.38,39.2 | 34.29,39.12 35.05,39.12 35.31,39.12 38.1,39.12 | 39.37,27.43 39.88,26.92 | 45.87,39.52 46.35,40.01 | 39.62,26.42 40.13,26.92 | C2.1 83.19,42.2 U2.1 v83.19,37.08 | 83.19,24.64 U1.1 83.19,19.43 v82.04,18.29 | 83.19,24.64 v83.19,25.91 | C1.1 83.19,24.64
  Bottom 0.406: v53.85,26.92 v40.64,26.92 | v62.48,18.29 v82.04,18.29 | v83.19,25.91 v83.19,37.08
+3V3A
  Bottom 0.254: 56.9,78.74 57.4,78.23 57.91,78.74 | 67.82,78.74 68.33,78.23 68.83,78.74 | 78.23,78.74 78.74,78.23 79.25,78.74 | 98.81,67.06 98.3,66.55 98.81,66.04
  Bottom 0.406: EXT2.1 65.53,58.42 64.26,59.69 62.99,59.69 62.23,60.45 62.23,61.47 61.21,62.48 58.17,62.48 52.07,68.58 52.07,75.69 55.12,78.74 56.9,78.74 57.4,78.74 | 57.4,78.74 57.91,78.74 67.82,78.74 68.33,78.74 | 68.33,78.74 68.83,78.74 78.23,78.74 78.74,78.74 | 78.74,78.74 79.25,78.74 96.52,78.74 97.62,77.64 R37.2 97.79,77.47 98.81,76.45 98.81,67.06 98.81,66.55 | R15.2 57.4,78.23 57.4,78.74 | R29.2 78.74,77.47 78.74,78.23 78.74,78.74 | R22.2 68.33,78.23 68.33,78.74 | 98.81,66.55 98.81,66.04 98.81,56.81 R53.2 | R45.2 98.3,66.55 98.81,66.55
+5V  (via drill 0.5, 0.6, 0.9)
  Top 0.254: U8.8 19.3,57.91 17.02,60.2 | 17.02,60.2 C9.1 | 45.12,3.81 48.51,3.81 S3.3 | J4.1 45.12,3.81 | 45.12,3.81 45.12,5.92 C12.1 49.53,10.33 49.53,11.18 | J5.1 31.5,9.31 C13.1 31.5,9.4 31.5,10.92 | U5.16 31.41,11.37 31.41,11.26 31.5,11.18 31.5,10.92 | 18.12,11.21 U4.16 | J3.1 18.03,9.31 C14.1 18.03,9.4 18.03,10.92 | 17.95,11.39 U4.16 | 49.53,11.18 49.53,11.43 | U3.16 49.53,11.68 | 49.53,11.68 49.53,11.43 | 49.53,11.43 49.78,11.43 | 49.78,11.43 v50.8,11.43 | v56.64,15.49 55.88,16.26 U3.4 | 49.53,11.18 49.78,11.43 | 49.53,11.68 49.78,11.43 | 18.03,10.92 18.03,11.43 U4.16 | 17.78,11.18 18.03,10.92 | 18.03,10.92 18.29,11.18 | 31.5,10.92 31.75,11.18 | 31.5,10.92 31.24,11.18 | C8.1 16.93,62.14 16.76,61.98 | 16.51,62.23 16.51,61.98 | 17.02,60.2 16.76,60.2
  Top 0.406: 17.02,60.71 C9.1 | U7.16 26.67,66.55 27.18,66.04 27.18,64.52 26.59,63.93 U7.12 21.41,63.93 20.75,64.59 U7.4 18.87,64.59 18.03,63.75 18.03,62.99 17.53,62.48 17.36,62.48 C8.1 | v15.49,62.74 15.24,62.48 15.49,62.48 | 16.76,62.48 16.51,62.23 | v85.34,11.94 83.34,11.94 U1.16 | v85.34,30.99 83.29,30.99 U2.16
  Top 0.813: v15.49,62.74 15.49,62.48 15.49,60.58 | 15.49,60.58 R7.2 13.9,59.89 Q2.E | 15.49,60.58 16.73,60.58 C9.1 | 17.02,60.71 C8.1 | 14.22,61.47 16.76,61.47 16.76,61.98 16.51,61.98 14.48,61.98 14.22,62.23 | 16.76,60.2 16,60.2 14.73,58.93 14.73,60.45 14.22,60.96 16.76,60.96
  Bottom 0.254: v50.8,11.43 53.85,11.43 56.64,14.22 v56.64,15.49
  Bottom 0.406: 68.83,38.86 83.57,38.86 86.61,35.81 C45.1 | 68.83,38.86 64.77,38.86 62.74,40.89 S4.3 | U12.16 69.15,41.63 C40.1 68.83,38.86 | U11.16 68.58,54.33 C31.1 60.79,54.01 57.15,57.66 57.15,61.47 54.86,63.75 38.35,63.75 EXT2.26 | 92.2,32.26 92.2,30.73 91.19,29.72 87.97,29.72 C45.1 | 92.2,32.26 J2.7 | 92.2,32.26 92.71,32.77 | 92.2,12.95 91.95,12.95 90.93,11.94 89.92,11.94 | 89.92,11.94 86.61,11.94 | 86.61,11.94 v85.34,11.94 | 89.92,11.94 90.17,11.68 90.17,11.18 | C44.1 86.61,11.94 | v85.34,30.99 86.53,30.99 C45.1
  Bottom 0.813: EXT2.26 35.56,75.18 32.26,78.49 13.72,78.49 8.08,72.85 PS1.1 | 18.29,1.27 9.4,1.27 8.64,2.03 8.64,6.1 1.52,13.21 1.52,53.34 8.08,59.9 PS1.1 | 18.29,1.27 31.5,1.27 | 31.5,1.27 44.96,1.27 | 44.96,1.27 80.52,1.27 92.2,12.95 | J4.1 44.96,1.27 | J5.1 31.5,1.27 | J3.1 18.03,1.52 18.29,1.27 | PS1.1 9.4,65.02 | 9.4,65.02 13.21,65.02 v15.49,62.74 | 92.2,12.95 J1.7 93.47,14.22 | J2.7 95.25,33.02 97.79,30.48 97.79,16.76 95.25,14.22 93.47,14.22 | 92.2,12.95 93.47,14.22 | 8.13,63.75 9.4,65.02 | 8.13,66.29 9.4,65.02
ADC_FC_SEL
  Bottom 0.254: 69.34,45.72 77.72,45.72 79.63,43.81 U12.9 | 69.34,45.72 69.34,48.77 72.64,52.07 78.99,52.07 79.63,52.7 U11.9 79.5,54.2 | S4.2 64.26,43.94 66.04,45.72 69.34,45.72
ENC1_CHA+  (via drill 0.5)
  Top 0.254: v59.69,12.45 U3.1
  Bottom 0.254: v59.69,12.45 62.23,12.45 63.55,11.13 J6.2
ENC1_CHA-
  Top 0.254: U3.2 59.94,13.72 62.23,11.43 62.23,4.89 J6.1
ENC1_CHB+
  Top 0.254: U3.7 56.64,20.07 64.26,12.45 64.52,12.19 65.55,11.16 J6.4
ENC1_CHB-
  Top 0.254: U3.6 56.9,18.8 64.52,11.18 64.52,4.6 J6.3
ENC1_DATA  (via drill 0.5)
  Top 0.254: U7.3 v21.39,65.23 | U8.2 v21.59,58.42
  Bottom 0.254: v21.39,65.23 22.1,64.52 22.1,60.71 21.08,59.69 21.08,58.93 v21.59,58.42
ENC2_CHA+  (via drill 0.5)
  Top 0.254: v51.31,21.34 U3.9 | v57.4,21.34 67.55,11.19 J6.6
  Bottom 0.254: v57.4,21.34 v51.31,21.34
ENC2_CHA-  (via drill 0.5)
  Top 0.254: v57.66,20.07 65.66,12.06 65.79,11.94 66.55,11.18 66.55,4.57 J6.5 | v51.31,20.07 U3.10
  Bottom 0.254: v57.66,20.07 v51.31,20.07
ENC2_CHB+
  Top 0.254: U3.15 50.8,13.72 52.32,12.19 52.32,9.14 59.69,1.78 69.6,1.78 70.87,3.05 70.87,4.25 J6.8
ENC2_CHB-
  Top 0.254: U3.14 51.05,14.99 52.83,13.21 52.83,9.4 59.94,2.29 68.26,2.29 J6.7
ENC2_DATA
  Top 0.254: U7.5 19.23,63.93 18.8,63.5 18.8,59.94 19.3,59.44 U8.5
ENC_PWR
  Top 0.406: Q2.C 12.95,64.52 10.92,66.55 10.92,73.41 15.24,77.72 19.81,77.72 | 19.81,77.72 20.32,77.72 | 20.32,77.72 30.94,77.72 J9.1 | J8.1 20.03,77.44 20.07,77.47 | 20.07,77.47 20.32,77.72 | 20.07,77.47 19.81,77.72
FLYW_RS-485_RXD0
  Top 0.254: J1.1 92.46,20.32 94.49,18.29 94.49,13.46 92.2,11.18 89.41,11.18 85.85,14.73 81.53,14.73 80.64,13.84 U1.14 80.64,10.79 79.25,9.4 73.66,9.4 71.12,11.94 71.12,13.72 71.88,14.48 JP2.2
FLYW_RS-485_RXD1
  Top 0.254: J1.2 92.71,19.3 93.98,18.03 93.98,13.72 91.95,11.68 89.66,11.68 86.11,15.24 80.77,15.24 79.38,13.84 U1.13 79.38,10.79 78.49,9.91 73.91,9.91 71.97,11.85 R2.1
FLYW_RS-485_TXD0
  Top 0.254: J1.5 76.96,16.26 | 76.96,16.26 76.71,16.26 | 76.71,16.26 76.45,16.26 | 76.45,16.26 73.66,16.26 JP1.2 71.88,17.78 | U1.11 76.96,12.22 76.96,12.95 76.71,12.95 76.71,16 | 76.71,16 76.71,16.26 | 76.71,16 76.45,16.26 | 76.71,16 76.96,16.26
FLYW_RS-485_TXD1
  Top 0.254: R1.1 75.27,17.27 J1.4 92.71,17.27 93.47,16.51 93.47,13.97 91.69,12.19 89.92,12.19 86.36,15.75 80.01,15.75 78.11,13.84 U1.12
FRONT_WHEEL_ENC_A
  Top 0.254: J3.3 12.95,13.46 14.73,15.24 U4.13
FRONT_WHEEL_ENC_B
  Top 0.254: J3.2 15.49,2.54 14.73,1.78 12.45,1.78 11.68,2.54 11.68,14.22 11.68,14.48 16.26,19.05 U4.10
GND  (via drill 0.5, 0.7)
  Top 0.203: U10.20 55.53,42.07 55.36,41.89 U10.18 | U13.18 15.48,44.69 15.66,44.87 U13.20
  Top 0.254: 50.63,40.13 C6.2 50.38,39.88 50.8,39.88 51.31,40.39 51.31,41.15 52.23,42.07 U10.11 | U13.11 11.59,44.87 11.18,44.45
  Top 0.406: C5.2 47.59,41.74
  other vias: 44.96,44.45 20.07,60.71 41.66,21.84 23.11,69.6 78.49,62.99 29.46,31.24 81.28,9.65 74.93,14.48 67.56,44.45 63.25,49.78 74.93,33.27 44.7,52.32 67.06,40.13 54.61,38.86
  pour Bottom: 0.51,79.76 99.57,79.76 99.57,0.51 0.51,0.51 0.51,78.99
  pour Top: 0.76,79.25 99.57,79.25 99.57,0.51 0.76,0.51 0.76,78.49
IMU2/SPI1_IMU_NSS  (via drill 0.6)
  Top 0.254: U13.22 16.82,45.67 17.78,44.7 17.78,43.69 v17.27,43.18
  Bottom 0.254: v17.27,43.18 EXT3.5
IMU2/SPI1_MISO
  Top 0.254: U13.9 12.25,45.67 9.65,48.26 EXT3.3
IMU2/SPI1_MOSI  (via drill 0.6)
  Top 0.254: U13.24 16.03,49.76 v14.99,50.8
  Bottom 0.254: v14.99,50.8 EXT3.2
IMU2/SPI1_SCK  (via drill 0.6)
  Top 0.254: U13.23 16.86,46.07 17.53,46.74 v17.53,48.01
  Bottom 0.254: v17.53,48.01 16.76,48.77 8.38,48.77 EXT3.4
IMU2_INT
  Top 0.254: U13.12 12.21,44.47 8.38,40.64 EXT3.6
IMU2_PWR
  Top 0.203: U13.1 15.48,46.47 15.22,46.21 | U13.13 13.48,44.47 13.73,44.72
  Top 0.254: 13.73,44.72 15.08,46.07 | 15.08,46.07 15.22,46.21 | U13.8 15.08,46.07 | U13.1 15.48,47.77 13.72,49.53 13.55,49.53 C43.1 C42.1 13.3,51.22 12.19,52.32 6.35,52.32 EXT3.1
INCR_ENC1_CHA  (via drill 0.5)
  Top 0.254: U3.3 v52.32,14.99 | U4.2 24.89,12.7 v27.69,9.91
  Bottom 0.254: v27.69,9.91 42.42,9.91 47.5,14.99 v52.32,14.99
INCR_ENC1_CHB  (via drill 0.5)
  Top 0.254: U3.5 v52.58,17.53 | v28.45,13.97 25.91,16.51 U4.5
  Bottom 0.254: v52.58,17.53 47.75,17.53 41.15,10.92 31.5,10.92 v28.45,13.97
INCR_ENC2_CHA  (via drill 0.5)
  Top 0.254: U3.11 v47.75,18.8 | v20.07,17.78 U4.11
  Bottom 0.254: v47.75,18.8 40.39,11.43 33.02,11.43 26.67,17.78 v20.07,17.78
INCR_ENC2_CHB  (via drill 0.5)
  Top 0.254: U3.13 v47.75,16.26 | U4.14 v19.81,13.97
  Bottom 0.254: v47.75,16.26 41.91,10.41 28.19,10.41 24.64,13.97 v19.81,13.97
N$1
  Top 0.254: U10.10 51.27,42.47 C6.1
N$2
  Top 0.254: Q1.1 R5.1 R6.2
N$3
  Top 0.406: R8.2 R7.1 11.55,61.7 Q2.B
N$4
  Top 0.406: Q3.3 16.85,53.76 16,54.61 R8.1
N$5
  Top 0.254: R9.2 R10.2 Q3.1
N$6
  Bottom 0.254: R36.2 R33.1
N$10
  Bottom 0.254: R30.1 R34.1 78.4,71.79 79.76,73.15 79.76,76.45 80.26,76.96 80.26,77.13 R29.1 R32.2 82.21,77.05 83.57,75.69 83.57,75.53 R33.2
N$12
  Top 0.254: U13.10 10.7,45.27 C41.1
N$14
  Top 0.203: U10.13 53.36,41.67 53.59,41.91 | U10.1 55.36,43.67 55.12,43.43
  Top 0.254: 54.96,43.27 U10.8 52.23,43.27 51.82,43.69 51.82,44.79 C4.1 C3.1 41.64,46.06 Q1.2 | 54.96,43.27 53.59,41.91 | 54.96,43.27 55.12,43.43
N$15
  Bottom 0.254: R18.2 R15.1 | R20.1 R16.1 59.52,73.66 R19.2
  Bottom 0.305: R19.2 59.78,75.77
  Bottom 0.406: 59.78,75.77 R18.2
N$17
  Bottom 0.254: R38.1 R42.1 87.03,71.79 88.65,73.41 92.71,73.41 94.32,75.02 R41.2 R40.2 R37.1
N$20
  Top 0.254: JP1.1 70.27,18.12 R1.2
N$24
  Top 0.254: R3.2 70.27,36.92 JP3.1
N$27
  Bottom 0.254: R46.2 C32.1 R47.1
N$28  (via drill 0.5)
  Top 0.254: v81.03,52.58 v73.15,44.7
  Bottom 0.254: R47.2 C33.1 85.6,54.36 83.82,52.58 v81.03,52.58 | U12.15 72.01,43.56 v73.15,44.7
N$29
  Bottom 0.254: R50.2 C34.1 R51.1
N$31
  Bottom 0.254: R51.2 C35.1 87.03,54.27 84.33,51.56 72.9,51.56 70.74,49.4 U12.1
N$32
  Bottom 0.254: R54.2 C36.1 R55.1
N$33
  Bottom 0.254: R55.2 C37.1 86.02,48.6 83.57,51.05 73.66,51.05 72.01,49.4 U12.2
N$34
  Bottom 0.254: R58.2 C38.1 R59.1
N$35
  Bottom 0.254: R59.2 C39.1 82.38,50.55 74.42,50.55 73.28,49.4 U12.3
N$37
  Top 0.254: 39.79,39.2 R6.1 39.79,38.7 40.39,38.1 43.43,38.1 44.55,39.22 U9.4
N$42
  Bottom 0.254: J15.1 96.27,51.98 R56.1
N$45
  Bottom 0.254: R22.1 R25.2 70.7,75.77 R26.2 69.76,72.98 R27.1 R23.1
  Bottom 0.406: R26.2 70.7,73.75
N$47
  Bottom 0.254: J14.1 96.27,62.74 97.62,64.1 R48.1
N$49
  Top 0.254: S3.2 50.8,1.78 50.04,1.02 39.88,1.02 | 39.88,1.02 38.61,2.29 38.61,10.92 38.1,11.43 U5.1 37.24,11.43 | 39.88,1.02 24.13,1.02 22.61,2.54 22.61,10.67 23.37,11.43 U4.1
N$50
  Bottom 0.254: J12.1 85.18,76.2 R32.1
N$51
  Top 0.254: R2.2 70.36,13.04 JP2.1
N$52
  Top 0.254: R4.2 70.27,34.2 JP4.1
N$53
  Bottom 0.254: R18.1 60.03,77.22 60.2,77.22 61.21,76.2 J10.1
N$56
  Bottom 0.254: R30.2 C23.1 R31.1
N$57
  Bottom 0.254: R31.2 C24.1 77.09,64.48 U11.6
N$58
  Bottom 0.254: R41.1 92.96,75.53 92.96,75.69 93.98,76.71 93.98,77.22 94.23,77.47 R44.2
N$59
  Bottom 0.254: R45.1 R48.2 R49.2 94.07,64.1 92.71,62.74 88.56,62.74 R50.1 R46.1
N$60
  Bottom 0.254: R49.1 R52.2
N$61
  Bottom 0.254: R53.1 R56.2 R57.2 89.41,48.43 89.41,41.15 88.65,40.39 87.12,40.39 86.36,41.15 86.36,41.31 R54.1 R58.1
N$62
  Bottom 0.254: R57.1 R60.2
N$63
  Bottom 0.254: J13.1 96.27,73.66 97.62,75.02 R40.1
N$64
  Bottom 0.254: R34.2 C25.1 R35.1
N$65
  Bottom 0.254: R35.2 C26.1 78.49,64.77 80.77,62.48 80.77,58.93 78.36,56.52 U11.10 78.23,54.46 78.23,55.12
N$66
  Bottom 0.254: R38.2 C27.1 R39.1
N$67  (via drill 0.5)
  Top 0.254: v83.06,62.48 v78.49,57.91
  Bottom 0.254: R39.2 C28.1 85.34,64.77 v83.06,62.48 | U11.11 77.09,56.52 v78.49,57.91
N$68
  Bottom 0.254: R42.2 C29.1 R43.1
N$69  (via drill 0.5)
  Top 0.254: v85.6,63.25 82.55,63.25 v77.22,57.91
  Bottom 0.254: R43.2 C30.1 87.03,64.68 v85.6,63.25 | U11.12 75.82,56.52 v77.22,57.91
N$70
  Bottom 0.254: R17.1 C15.1 R16.2
N$71
  Bottom 0.254: R17.2 C16.1 61.05,63.25 63.5,63.25 64.77,61.98 64.77,60.45 65.53,59.69 67.56,59.69 72.01,55.24 U11.15 71.88,54.46 71.88,55.12
N$72
  Bottom 0.254: R21.1 C17.1 R20.2
N$73
  Bottom 0.254: R21.2 C18.1 62.14,63.75 68.07,63.75 70.74,61.09 U11.1
N$74
  Bottom 0.254: R24.1 C19.1 R23.2
N$75
  Bottom 0.254: R24.2 C20.1 68.33,64.77 68.58,64.52 68.58,64.26 69.85,62.99 71.12,62.99 72.01,62.1 U11.2
N$76
  Bottom 0.254: R27.2 C21.1 R28.1
N$77
  Bottom 0.254: R28.2 C22.1 71.03,63.5 71.88,63.5 73.28,62.1 U11.3
PA0/TIM5_CH1/ENC1_CHA  (via drill 0.5)
  Top 0.254: EXT2.4 62.23,59.69 55.63,59.69 54.61,58.67 54.61,57.66 53.34,56.39 41.91,56.39 38.1,52.58 v31.75,52.58 | v21.84,18.8 21.84,16 22.61,15.24 U4.4
  Bottom 0.254: v31.75,52.58 30.73,52.58 21.84,43.69 v21.84,18.8
PA1/TIM5_CH2/ENC1_CHB  (via drill 0.5)
  Top 0.254: EXT2.8 57.15,62.23 52.83,62.23 52.07,61.47 52.07,57.91 51.05,56.9 41.66,56.9 38.35,53.59 v30.73,53.59 | v20.83,22.61 20.83,21.59 23.37,19.05 U4.7
  Bottom 0.254: v30.73,53.59 20.83,43.69 v20.83,22.61
PA3/SPI1_ENC2_NSS  (via drill 0.5)
  Top 0.254: U8.7 20.57,58.42 21.84,57.15 v22.86,57.15 | v27.69,59.44 U6.5 v25.4,59.44 | v32,62.74 v39.37,62.74
  Bottom 0.254: v27.69,59.44 30.99,62.74 v32,62.74 | v39.37,62.74 54.1,62.74 EXT2.10 | v25.4,59.44 25.15,59.44 v22.86,57.15
PA4/SPI1_ENC1_NSS  (via drill 0.5)
  Top 0.254: U8.1 23.88,57.91 24.89,56.9 v26.16,56.9 | U6.1 29.46,57.91 29.46,57.66 | 29.46,57.66 v29.46,56.9 35.81,56.9 36.83,57.91 36.83,58.93 37.59,59.69 v41.4,59.69 | 29.21,57.91 29.46,57.66 | 29.46,57.66 29.72,57.91
  Bottom 0.254: v26.16,56.9 v29.46,56.9 | EXT2.11 52.07,59.69 52.07,61.47 51.31,62.23 47.75,62.23 46.99,61.47 46.99,60.45 46.23,59.69 v41.4,59.69
PA5/SPI1_SCK  (via drill 0.5)
  Top 0.254: U10.23 57.06,43.27 62.23,38.1 62.23,35.05 61.47,34.29 57.15,34.29 EXT1.18 | U6.6 27.18,58.93 27.69,58.42 U6.2 v30.48,58.42
  Bottom 0.254: EXT1.18 54.61,34.29 50.29,34.29 49.53,33.53 49.53,32.51 48.77,31.75 35.05,31.75 33.78,33.02 33.78,55.12 v30.48,58.42
PA6/SPI1_MISO  (via drill 0.5)
  Top 0.254: U10.9 49.98,42.87 48.77,41.66 48.77,39.37 52.07,36.07 52.07,34.8 50.8,33.53 EXT1.14 | U8.6 21.08,58.93 21.34,59.18 21.84,59.18 22.1,58.93 U8.3 23.88,58.93 v25.15,57.66
  Bottom 0.254: v25.15,57.66 30.23,57.66 33.27,54.61 33.27,32.77 34.8,31.24 49.02,31.24 EXT1.14
PA7/SPI1_MOSI
  Top 0.254: U10.24 57.42,43.67 64.77,36.32 64.77,35.05 64.01,34.29 62.23,34.29 EXT1.22
PA8/TIM1_CH1/M1_PWM  (via drill 0.6)
  Top 0.254: J7.1 49.21,77.72 44.7,77.72 44.2,77.72 43.94,77.72 34.54,68.33 v34.54,65.79
  Bottom 0.254: EXT1.2 35.56,33.53 34.29,34.8 34.29,55.37 33.02,56.64 33.02,64.26 v34.54,65.79
PA9/TIM1_CH2/M2_PWM  (via drill 0.5)
  Top 0.254: J7.2 51.56,75.5 51.56,76.96 50.29,78.23 43.69,78.23 33.78,68.33 v33.78,63.5
  Bottom 0.254: EXT1.4 36.83,34.29 36.83,36.07 34.8,38.1 34.8,55.63 33.78,56.64 v33.78,63.5
PA10/SPI1_PWR  (via drill 0.5)
  Top 0.254: v43.18,41.15 44.7,41.15 45.21,41.66 U9.2 | v37.08,45.47 35.56,46.99 25.4,46.99 23.11,49.28 R9.1
  Bottom 0.254: EXT1.7 v43.18,41.15 38.86,45.47 v37.08,45.47
PB0/SPI1_IMU_NSS
  Top 0.254: EXT1.21 60.96,38.61 56.7,42.87 U10.22
PB1/SD_CD  (via drill 0.7)
  Top 0.406: EXT1.26 v61.47,28.45 | v23.62,37.08 17.44,37.08 15.86,35.5 X1.CD
  Bottom 0.406: v23.62,37.08 27.18,33.53 27.18,31.24 29.97,28.45 v61.47,28.45
PB5/IMU_INT  (via drill 0.5)
  Top 0.254: v51.82,39.37 51.82,40.89 52.59,41.67 U10.12
  Bottom 0.254: v51.82,39.37 51.82,38.61 49.53,36.32 49.53,34.29 EXT1.12
PB6/USART1_TX/TIM4_CH1  (via drill 0.5)
  Top 0.254: EXT1.13 49.53,34.29 49.53,25.4 v46.48,22.35 | 36.83,15.24 U5.4 v39.37,15.24
  Bottom 0.254: v39.37,15.24 v46.48,22.35
PB6/USART1_TX/XPC_RS-485_D  (via drill 0.5)
  Top 0.254: U2.6 76.83,37.47 v76.2,36.83 | U5.2 v39.37,12.7
  Bottom 0.254: v39.37,12.7 49.28,22.61 61.98,22.61 v76.2,36.83
PB7/USART1_RX/TIM4_CH2
  Top 0.254: EXT1.15 53.34,35.05 52.07,33.78 52.07,26.42 44.7,19.05 U5.7
PB7/USART1_RX/XPC_RS-485_R  (via drill 0.5)
  Top 0.254: U2.3 80.64,38.48 v79.76,37.59 | U5.5 v39.37,16.51
  Bottom 0.254: v79.76,37.59 75.69,37.59 61.21,23.11 45.97,23.11 v39.37,16.51
PB8/FLYW_RS-485_DE
  Top 0.254: EXT1.16 62.23,24.13 76.96,24.13 78.11,22.99 U1.5
PB9/FLYW_RS-485_NRE
  Top 0.254: EXT1.17 54.61,34.29 54.61,32.51 62.48,24.64 77.72,24.64 79.38,22.99 U1.4
PB10/USART3_TX/FLYW_RS-485_D  (via drill 0.5)
  Top 0.254: U1.6 76.83,22.99 v76.45,23.37 | v52.07,52.83 68.83,36.07 68.83,30.99 v73.91,25.91
  Bottom 0.254: EXT2.14 50.8,59.94 52.07,58.67 v52.07,52.83 | v76.45,23.37 v73.91,25.91
PB11/USART3_RX/FLYW_RS-485_R  (via drill 0.5)
  Top 0.254: U1.3 80.64,22.99 78.49,25.15 73.66,25.15 68.33,30.48 68.33,35.56 v48.26,55.63
  Bottom 0.254: v48.26,55.63 EXT2.15
PB12/M1_EN
  Top 0.254: EXT2.17 46.99,59.69 48.77,59.69 49.53,60.45 49.53,75.41 J7.3
PB13/M2_EN
  Top 0.254: EXT2.16 48.26,74.2 J7.4
PB14/M1_RDY
  Top 0.254: EXT2.18 45.72,71.63 47.5,73.41 47.5,75.44 J7.5
PB15/M2_RDY
  Top 0.254: EXT2.19 44.45,59.69 44.45,72.39 J7.6
PC0/ADC10/M1_CURRENT
  Bottom 0.254: U11.14 73.28,53.47 71.37,51.56 69.34,51.56 58.42,40.64 EXT1.19
PC1/ADC11/M2_CURRENT  (via drill 0.5)
  Top 0.254: v73.41,58.42 73.41,56.39 v69.6,52.58
  Bottom 0.254: 74.55,59.82 U11.4 74.55,59.56 v73.41,58.42 | v69.6,52.58 57.15,40.13 57.15,34.29 EXT1.20
PC2/ADC12/RIDER_TORQUE
  Bottom 0.254: EXT2.2 67.31,60.96 70.61,57.66 73.91,57.66 75.82,59.56 U11.5 75.69,60.35 75.69,59.69
PC3/ADC13  (via drill 0.5)
  Top 0.254: v71.63,56.9 57.4,56.9 EXT2.9
  Bottom 0.254: v71.63,56.9 73.66,56.9 74.55,56.01 U11.13
PC4/ADC14  (via drill 0.5)
  Top 0.254: v74.42,44.7 77.72,48.01 S1.1
  Bottom 0.254: U12.14 73.28,43.56 v74.42,44.7
PC4/XPC_RS-485_DE
  Top 0.254: U2.5 78.11,42.29 81.03,45.21 86.87,45.21 88.14,46.48 S1.3
PC4/XPC_RS-485_DE/ADC14  (via drill 0.5)
  Top 0.254: S1.2 86.61,46.74 85.6,45.72 80.52,45.72 77.22,42.42 63.75,42.42 v60.2,45.97
  Bottom 0.254: EXT2.12 54.61,59.69 54.61,51.56 v60.2,45.97
PC5/ADC15  (via drill 0.5)
  Top 0.254: v80.77,49.78 84.58,49.78 S2.1
  Bottom 0.254: U12.4 74.55,48.64 75.69,49.78 v80.77,49.78
PC5/XPC_RS-485_NRE
  Top 0.254: 79.38,41.02 U2.4 79.38,42.04 82.04,44.7 87.38,44.7 89.41,46.74 89.41,48.77 88.39,49.78 88.39,50.04 S2.3
PC5/XPC_RS-485_NRE/ADC15  (via drill 0.5)
  Top 0.254: v50.8,55.63 55.12,51.31 77.47,51.31 80.01,53.85 84.84,53.85 86.61,52.07 S2.2
  Bottom 0.254: EXT2.13 v50.8,55.63
PC6/TIM3_CH1/ENC2_CHA  (via drill 0.5)
  Top 0.254: EXT2.20 43.18,60.2 41.91,58.93 41.91,57.91 38.61,54.61 v31.75,54.61 | v19.81,21.59 18.54,20.32 U4.9
  Bottom 0.254: v31.75,54.61 30.73,54.61 19.81,43.69 v19.81,21.59
PC7/TIM3_CH2/ENC2_CHB  (via drill 0.5)
  Top 0.254: v30.73,55.63 37.85,55.63 EXT2.21 | v16,17.53 17.02,16.51 U4.12
  Bottom 0.254: v16,17.53 16,19.81 19.3,23.11 19.3,44.2 v30.73,55.63
PC8/SD_D0  (via drill 0.5)
  Top 0.254: R12.1 33.53,39.97 33.53,42.67 v35.56,44.7
  Top 0.406: R12.1 17.02,39.12 12.98,35.07 X1.DATA0
  Bottom 0.254: EXT2.22 39.37,59.69 39.37,57.66 36.32,54.61 36.32,45.47 v35.56,44.7
PC9/SD_D1  (via drill 0.5)
  Top 0.254: R13.1 32.68,43.09 v35.56,45.97
  Top 0.406: R13.1 18.03,41.66 12.55,36.17 X1.DATA1
  Bottom 0.254: EXT2.24 36.83,59.69 36.83,57.91 35.56,56.64 v35.56,45.97
PC10/SD_D2
  Top 0.406: EXT1.8 43.18,26.92 40.64,24.38 39.46,24.38 R14.1 39.28,24.3 38.1,23.11 31.5,23.11 27.94,26.67 14.99,26.67 13.18,28.47 X1.DATA2
PC11/SD_D3
  Top 0.254: EXT1.9 44.45,34.29 42.67,34.29 41.91,33.53 41.91,26.92 40.13,25.15 37.93,25.15 R11.1
  Top 0.406: R11.1 31.84,24.3 28.45,27.69 15.24,27.69 13.35,29.57 X1.CD/DATA3
PC12/SD_CLK  (via drill 0.5, 0.7)
  Top 0.406: v44.2,30.48 45.72,32 EXT1.10 | v28.85,36.17 27.76,36.17 27.76,36.18 19.67,36.18 17.27,33.78 12.95,33.78 12.05,32.87 X1.CLK
  Bottom 0.406: v28.85,36.17 34.54,30.48 v44.2,30.48
PC13/TORQUE_MEAS_EN  (via drill 0.5)
  Top 0.254: v22.86,23.62 14.48,23.62 5.33,14.48 J16.1
  Bottom 0.254: EXT1.24 63.5,27.94 59.18,23.62 v22.86,23.62
PD2/SD_CMD  (via drill 0.5)
  Top 0.406: EXT1.11 46.99,34.29 46.99,31.75 v45.72,30.48 | v30.73,29.72 28.45,29.72 26.67,31.5 14.22,31.5 13.4,30.67 X1.CMD
  Bottom 0.406: v45.72,30.48 44.96,29.72 v30.73,29.72
PEDAL_ENC_A
  Top 0.254: U5.3 39.37,13.97 41.91,11.43 41.91,5.84 J4.3
PEDAL_ENC_B
  Top 0.254: J4.2 42.42,14.73 39.37,17.78 U5.6
REAR_WHEEL_ENC_A
  Top 0.254: J5.3 26.42,3.56 28.19,1.78 29.72,1.78 30.23,2.29 30.23,5.33 29.46,6.1 29.46,14.22 25.91,17.78 U4.6
REAR_WHEEL_ENC_B
  Top 0.254: J5.2 28.96,10.92 25.91,13.97 U4.3
SD_VDD
  Top 0.254: 34.77,28.7 34.8,28.7 34.42,29.08 | 34.77,28.7 34.38,28.7 | 34.39,28.32 34.77,28.7
  Top 0.406: C10.1 34.38,28.7 C11.1 34.29,29.97 31.5,32.77 13.97,32.77 12.98,31.77 X1.VDD | L1.2 34.8,28.7
SSI_ENC1_CLK  (via drill 0.5)
  Top 0.254: U7.15 25.04,65.89 24.89,66.04 v24.13,66.04 | U6.7 25.15,58.42 23.62,59.94 v23.62,60.71
  Bottom 0.254: v23.62,60.71 23.62,65.53 v24.13,66.04
SSI_ENC1_CLK+
  Top 0.254: U7.14 23.67,65.23 21.34,67.56 19.81,67.56 19.05,68.33 19.05,75.44 18.05,76.44 J8.3
SSI_ENC1_CLK-
  Top 0.254: U7.13 23.55,64.59 21.08,67.06 19.3,67.06 18.03,68.33 J8.4
SSI_ENC1_DATA+
  Top 0.254: U7.2 18.44,65.89 16,68.33 16,74.41 J8.6
SSI_ENC1_DATA-
  Top 0.254: U7.1 18.8,66.55 17.02,68.33 17.02,75.45 J8.5
SSI_ENC2_CLK
  Top 0.254: U6.3 28.7,58.93 28.45,59.18 28.45,61.21 27.69,61.98 U7.9
SSI_ENC2_CLK+
  Top 0.254: J9.3 31.24,75.42 31.24,66.04 27.84,62.64 U7.10
SSI_ENC2_CLK-
  Top 0.254: J9.4 30.23,65.79 27.74,63.3 U7.11
SSI_ENC2_DATA+  (via drill 0.5)
  Top 0.254: U7.6 23.06,63.3 25.15,61.21 v27.18,61.21 | v28.19,65.53 28.19,74.41 J9.6
  Bottom 0.254: v28.19,65.53 28.19,62.23 v27.18,61.21
SSI_ENC2_DATA-  (via drill 0.5)
  Top 0.254: U7.7 22.96,62.64 25.15,60.45 v26.16,60.45
  Bottom 0.254: v26.16,60.45 27.94,60.45 29.21,61.72 29.21,66.8 26.92,69.09 26.92,75.14 J9.5
X124
  Bottom 0.254: J11.1 71.97,76.2 R25.1
XPC_RS-485_RXD0
  Top 0.254: J2.1 92.46,39.12 94.49,37.08 94.49,32.26 92.2,29.97 89.41,29.97 85.85,33.53 81.53,33.53 80.64,32.64 U2.14 80.64,29.34 79.25,27.94 73.91,27.94 71.12,30.73 71.12,32.51 71.88,33.27 JP4.2
XPC_RS-485_RXD1
  Top 0.254: J2.2 92.71,38.1 93.98,36.83 93.98,32.51 91.95,30.48 89.66,30.48 86.11,34.04 80.77,34.04 79.38,32.64 U2.13 79.38,29.34 78.49,28.45 74.17,28.45 71.97,30.65 R4.1
XPC_RS-485_TXD0
  Top 0.254: J2.5 76.96,35.05 | 76.96,35.05 76.71,35.05 | 76.71,35.05 76.45,35.05 | 76.45,35.05 73.66,35.05 JP3.2 71.88,36.58 | U2.11 76.96,31.01 76.96,31.75 76.71,31.75 76.71,34.8 | 76.71,34.8 76.71,35.05 | 76.71,34.8 76.96,35.05 | 76.45,35.05 76.71,34.8
XPC_RS-485_TXD1
  Top 0.254: R3.1 75.27,36.07 J2.4 92.71,36.07 93.47,35.31 93.47,32.77 91.69,30.99 89.92,30.99 86.36,34.54 80.01,34.54 78.11,32.64 U2.12

### Text on the board
tPlace: SIG | ±4V:J10,J11 | GND | ±10V:J12-15 | +5V | 2 | GND | 1 | EXT2 | SELECT x2: | ADC14,15 | VCC | J2 (USART1) EN | MOSI | MISO | STM32-H405 BUT JUMPER / MUST BE DISCONNECTED | SCK | NSS | X | Y | COMPASS | INT | Y | ACC/GYRO | X | EXT1 | EXT1 | 1 | 2 | USART1/XPC | USART3/FLYW | CONNECT JP1-2, JP3-4 / IF 120R TERM / NEEDED FOR J1,J2 | MEAS_NEN | TIM3 | B | A | SELECT: | TIM5 | GND | +5V | J2,J6 | J3,J4,J5 | BKUP INCR ENC | 1A+ | 1B+ | 2A+ | 2B+ | 1A- | 1B- | 2A- | 2B-
bPlace: SELECT FC: | 194 Hz | 408 Hz